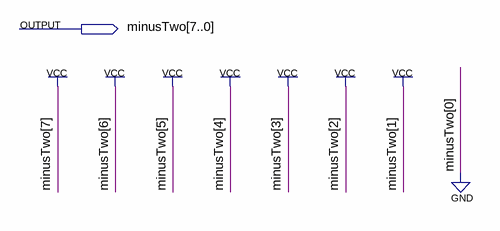
[diagram p0: schematic sheet]
// Quartus schematic minus2.bdf as structural Verilog: 0 symbols, 1 pins
module minus2 (
  output [7:0] minusTwo
);


  assign minusTwo = 8'b11111110;
endmodule
